# Altium schematic sheet ZYNQ_PWR.SchDoc
size A4
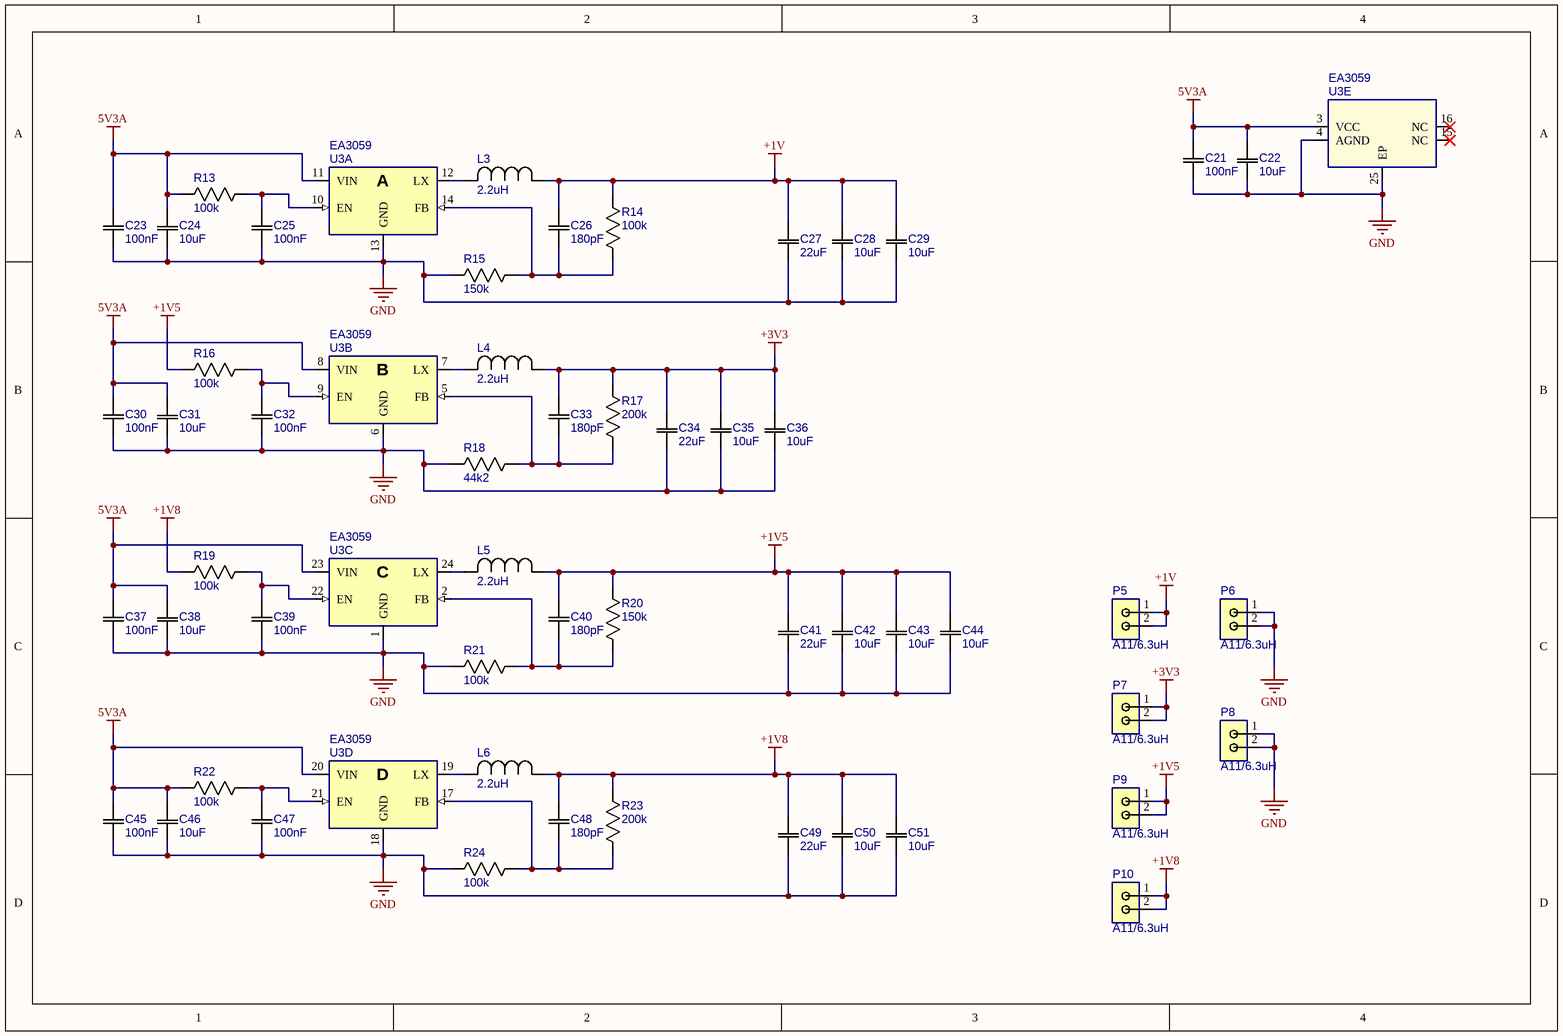
[diagram p0: ZYNQ_PWR.SchDoc]

## Parts
C21  100nF  [0402]
C22  10uF  [C0603]
C23  100nF  [0402]
C24  10uF  [C0603]
C25  100nF  [0402]
C26  180pF  [0402]
C27  22uF  [C0603]
C28  10uF  [C0603]
C29  10uF  [C0603]
C30  100nF  [0402]
C31  10uF  [C0603]
C32  100nF  [0402]
C33  180pF  [0402]
C34  22uF  [C0603]
C35  10uF  [C0603]
C36  10uF  [C0603]
C37  100nF  [0402]
C38  10uF  [C0603]
C39  100nF  [0402]
C40  180pF  [0402]
C41  22uF  [C0603]
C42  10uF  [C0603]
C43  10uF  [C0603]
C44  10uF  [C0603]
C45  100nF  [0402]
C46  10uF  [C0603]
C47  100nF  [0402]
C48  180pF  [0402]
C49  22uF  [C0603]
C50  10uF  [C0603]
C51  10uF  [C0603]
L3  2.2uH  [04x0SMD]
L4  2.2uH  [04x0SMD]
L5  2.2uH  [04x0SMD]
L6  2.2uH  [04x0SMD]
P5  A11/6.3uH  [2x3mmPad]
P6  A11/6.3uH  [2x3mmPad]
P7  A11/6.3uH  [2x3mmPad]
P8  A11/6.3uH  [2x3mmPad]
P9  A11/6.3uH  [2x3mmPad]
P10  A11/6.3uH  [2x3mmPad]
R13  100k  [0402]
R14  100k  [0402]
R15  150k  [0402]
R16  100k  [0402]
R17  200k  [0402]
R18  44k2  [0402]
R19  100k  [0402]
R20  150k  [0402]
R21  100k  [0402]
R22  100k  [0402]
R23  200k  [0402]
R24  100k  [0402]
U3  EA3059  [QFN-24]  (parts A,B,C,D,E of 5)

## Nets
5V3A: C21.1 C22.2 C23.1 C24.2 C30.1 C31.2 C37.1 C38.2 C45.1 C46.2 R13.1 R22.1 U3.3(VCC) U3.8(VIN) U3.11(VIN) U3.20(VIN) U3.23(VIN)
+1V: C26.1 C27.2 C28.2 C29.2 L3.1 P5.1(P0) P5.2(P1) R14.2
+1V5: C40.1 C41.2 C42.2 C43.2 C44.2 L5.1 P9.1(P0) P9.2(P1) R16.1 R20.2
+1V8: C48.1 C49.2 C50.2 C51.2 L6.1 P10.1(P0) P10.2(P1) R19.1 R23.2
+3V3: C33.1 C34.2 C35.2 C36.2 L4.1 P7.1(P0) P7.2(P1) R17.2
GND: C21.2 C22.1 C23.2 C24.1 C25.2 C27.1 C28.1 C29.1 C30.2 C31.1 C32.2 C34.1 C35.1 C36.1 C37.2 C38.1 C39.2 C41.1 C42.1 C43.1 C44.1 C45.2 C46.1 C47.2 C49.1 C50.1 C51.1 P6.1(P0) P6.2(P1) P8.1(P0) P8.2(P1) R15.2 R18.1 R21.1 R24.2 U3.1(GND) U3.4(AGND) U3.6(GND) U3.13(GND) U3.18(GND) U3.25(EP)
NetC25_1: C25.1 R13.2 U3.10(EN)
NetC26_2: C26.2 R14.1 R15.1 U3.14(FB)
NetC32_1: C32.1 R16.2 U3.9(EN)
NetC33_2: C33.2 R17.1 R18.2 U3.5(FB)
NetC39_1: C39.1 R19.2 U3.22(EN)
NetC40_2: C40.2 R20.1 R21.2 U3.2(FB)
NetC47_1: C47.1 R22.2 U3.21(EN)
NetC48_2: C48.2 R23.1 R24.1 U3.17(FB)
NetL3_2: L3.2 U3.12(LX)
NetL4_2: L4.2 U3.7(LX)
NetL5_2: L5.2 U3.24(LX)
NetL6_2: L6.2 U3.19(LX)

Not connected (* = marked no-connect by the designer): U3 15(NC)* 16(NC)*

## Notes on the sheet
- (in symbol EA3059, part A) A
- (in symbol EA3059, part B) B
- (in symbol EA3059, part C) C
- (in symbol EA3059, part D) D

## Library data of the parts
C21 C23 C25 C30 C32 C37 C39 C45 C47 = GCM155R71H104ME02J: GCM155R71H104ME02J / Multilayer Ceramic Capacitors MLCC - SMD/SMT; Mfr.: Murata Electronics; Mfr. No: GCM155R71H104ME02J; ComponentLink1Description: mouser; ComponentLink1URL: https://www.mouser.hk/ProductDetail/Murata-Electronics/GCM155R71H104ME02J?qs=QzBtWTOodeX25ZLBhHkqFQ%3D%3D; ComponentLink2Description: taobao; ComponentLink2URL: https://item.taobao.com/item.htm?spm=a1z10.3-c-s.w4002-24706531953.24.670d6a4bjaTv37&id=634658999620; Price: 0.02
C22 C24 C28 C29 C31 C35 C36 C38 C42-C44 C46 C50 C51 = taobao_10uF: OUDEIBUN / 50V 10% 106K X5R; Mfr. No: 106; ComponentLink1Description: taobao; ComponentLink1URL: https://detail.tmall.com/item.htm?abbucket=11&id=610884231672&rn=bfecce7903ee26d41e055cbdf2d2e6eb&spm=a1z10.3-b.w4011-22147617817.28.ed547d1efUUngR&skuId=4463564134689; Mfr.: OUDEIBUN; Price: 0.2
C26 C33 C40 C48 = CL05C181JB5NNNC: CL05C181JB5NNNC / 180pF(181) +/-5% 50V C0G; Mfr. No: Samsung; ComponentLink1Description: taobao; ComponentLink1URL: https://item.taobao.com/item.htm?spm=a1z10.3-c-s.w4002-24706531953.26.a6eb6a4bDB9NOZ&id=619556509633; Mfr.: CL05C181JB5NNNC; Price: 0.03
C27 C34 C41 C49 = taobao_22uF: OUDEIBUN / 25V 10% 226K X5R; Mfr. No: 226; ComponentLink1Description: taobao; ComponentLink1URL: https://detail.tmall.com/item.htm?abbucket=11&id=610150156146&rn=59afea97bc42016507be0d5449395d39&spm=a1z10.3-b.w4011-22147617817.29.2b4e7d1e4hXUjj&skuId=4292454384286; Mfr.: OUDEIBUN; Price: 0.6
L3-L6 = L0420: 4.6mmx4.1mm (LxH) DCDC Inductor SMD; Mfr.: Your Cee; Mfr. No: 0420_2R2; ComponentLink1Description: taobao; ComponentLink1URL: https://item.taobao.com/item.htm?spm=a1z10.5-c-s.w4002-24706531925.50.276641b1hW32l7&id=528437837997; Price: 0.45
P5-P10 = A11_QI_6u3H_DUAL: Mfr.: Huihai Longteng; Mfr. No: A11; ComponentLink1Description: taobao; ComponentLink1URL: https://item.taobao.com/item.htm?spm=a1z09.2.0.0.f1702e8dvag9Bh&id=535912863390&_u=f10quk0kb827; Price: 8.00
R13 R14 R16 R19 R21 R22 R24 = taobao_100k: OUDEIBUN / 1% 100k; Mfr.: UNIOHM; ComponentLink1Description: taobao; ComponentLink1URL: https://item.taobao.com/item.htm?spm=a1z09.2.0.0.44de2e8d3IDpt5&id=525633701805&_u=o10quk0k9fd0; Mfr. No: 100k; Price: 0.012
R15 R20 = taobao_150k: OUDEIBUN / 1% 150k; Mfr.: UNIOHM; ComponentLink1Description: taobao; ComponentLink1URL: https://detail.tmall.com/item.htm?abbucket=11&id=608928061564&rn=4c37b34fc9dccdc2648173b890fd7863&spm=a1z10.3-b.w4011-22147617817.39.76cf7d1eaF9LC8; Mfr. No: 150k; Price: 0.02
R17 R23 = taobao_200k: OUDEIBUN / 1% 200k; ComponentLink1Description: taobao; ComponentLink1URL: https://detail.tmall.com/item.htm?abbucket=11&id=608928769417&rn=96a7feb5c32a75cc27cfeb620927404b&spm=a1z10.3-b.w4011-22147617817.31.51a57d1eaagcwg&skuId=4451366407389; Mfr.: OUDEIBUN; Mfr. No: 200k; Price: 0.02
R18 = taobao_44k2: UNIOHM / 44k2 1% 1/16W; ComponentLink1Description: taobao; ComponentLink1URL: https://item.taobao.com/item.htm?spm=a1z10.3-c-s.w4002-24706531953.9.63cb6a4b6BhLES&id=525646668658; Mfr.: UNIOHM; Mfr. No: 44k2; Price: 0.012
U3 = EA3059: The EA3059 is a 4-CH power management IC for applications powered by one Li-Ion battery or a DC 5V adapter.; Mfr.: EverAnalog; Mfr. No: EA3059QDR; ComponentLink1Description: taobao; ComponentLink1URL: https://item.taobao.com/item.htm?spm=a230r.1.14.22.493b4027s4M1UI&id=677106542609&ns=1&abbucket=5#detail; Price: 1.0